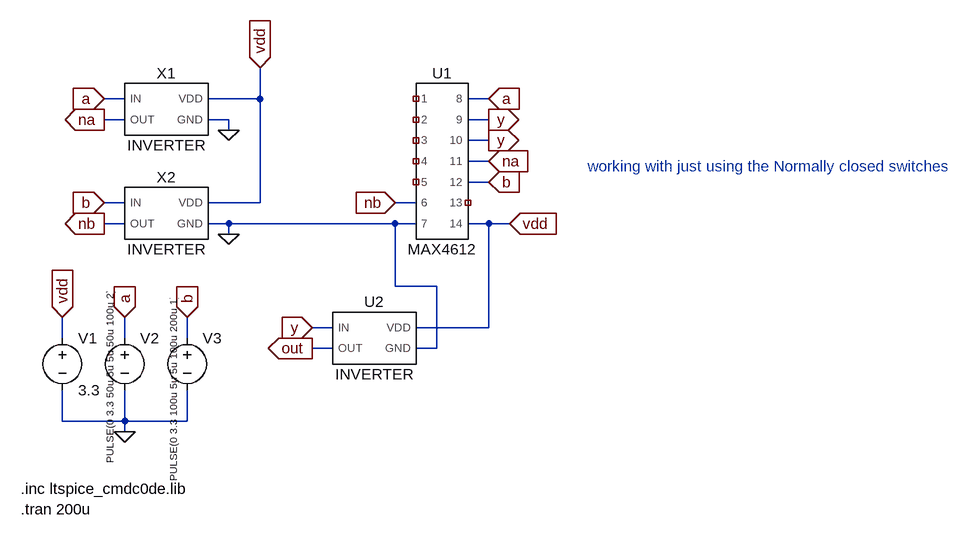
[diagram p0: schematic xor_tg_raw4.asc]
xor_tg_raw4.asc, the LTspice schematic file:
Version 4.1
SHEET 1 1368 1020
WIRE -16 80 -48 80
WIRE 192 80 192 32
WIRE 192 80 112 80
WIRE 544 80 512 80
WIRE -16 112 -48 112
WIRE 144 112 112 112
WIRE 544 112 512 112
WIRE 144 128 144 112
WIRE 544 144 512 144
WIRE 544 176 512 176
WIRE 544 208 512 208
WIRE -16 240 -48 240
WIRE 192 240 192 80
WIRE 192 240 112 240
WIRE 432 240 400 240
WIRE -16 272 -48 272
WIRE 144 272 112 272
WIRE 400 272 144 272
WIRE 432 272 400 272
WIRE 544 272 512 272
WIRE 576 272 544 272
WIRE 144 288 144 272
WIRE 400 368 400 272
WIRE 464 368 400 368
WIRE 304 432 272 432
WIRE 544 432 544 272
WIRE 544 432 432 432
WIRE -112 448 -112 416
WIRE -16 448 -16 416
WIRE 80 448 80 416
WIRE 304 464 272 464
WIRE 464 464 464 368
WIRE 464 464 432 464
WIRE -112 576 -112 528
WIRE -16 576 -16 528
WIRE -16 576 -112 576
WIRE 80 576 80 528
WIRE 80 576 -16 576
WIRE -16 592 -16 576
FLAG -48 80 a
IOPIN -48 80 In
FLAG -48 112 na
IOPIN -48 112 Out
FLAG 144 128 0
FLAG 144 288 0
FLAG -48 240 b
IOPIN -48 240 In
FLAG -48 272 nb
IOPIN -48 272 Out
FLAG -16 592 0
FLAG -112 416 vdd
IOPIN -112 416 In
FLAG -16 416 a
IOPIN -16 416 In
FLAG 80 416 b
IOPIN 80 416 In
FLAG 192 32 vdd
IOPIN 192 32 In
FLAG 576 272 vdd
IOPIN 576 272 In
FLAG 400 240 nb
IOPIN 400 240 In
FLAG 544 80 a
IOPIN 544 80 In
FLAG 544 112 y
IOPIN 544 112 Out
FLAG 544 208 b
IOPIN 544 208 In
FLAG 544 176 na
IOPIN 544 176 In
FLAG 544 144 y
IOPIN 544 144 Out
FLAG 272 432 y
IOPIN 272 432 In
FLAG 272 464 out
IOPIN 272 464 Out
SYMBOL inverter 48 96 R0
SYMATTR InstName X1
SYMATTR SpiceModel ""
SYMBOL inverter 48 256 R0
SYMATTR InstName X2
SYMATTR SpiceModel ""
SYMBOL voltage -112 432 R0
WINDOW 123 0 0 Left 0
WINDOW 39 0 0 Left 0
SYMATTR InstName V1
SYMATTR Value 3.3
SYMBOL voltage -16 432 R0
WINDOW 3 -23 209 VLeft 1
WINDOW 123 0 0 Left 0
WINDOW 39 0 0 Left 0
SYMATTR Value PULSE(0 3.3 50u 5u 5u 50u 100u 2)
SYMATTR InstName V2
SYMBOL voltage 80 432 R0
WINDOW 3 -21 237 VLeft 1
WINDOW 123 0 0 Left 0
WINDOW 39 0 0 Left 0
SYMATTR Value PULSE(0 3.3 100u 5u 5u 100u 200u 1)
SYMATTR InstName V3
SYMBOL max4612 464 176 R0
SYMATTR InstName U1
SYMBOL inverter 368 448 R0
SYMATTR InstName U2
TEXT -176 680 Left 2 !.inc ltspice_cmdc0de.lib\n.tran 200u
TEXT 696 184 Left 2 ;working with just using the Normally closed switches

The netlist it stands for:
* xor_tg_raw4.asc
X§X1 a na vdd 0 INVERTER  ; pins IN OUT VDD GND
X§X2 b nb vdd 0 INVERTER  ; pins IN OUT VDD GND
V1 vdd 0 3.3
V2 a 0 PULSE(0 3.3 50u 5u 5u 50u 100u 2)
V3 b 0 PULSE(0 3.3 100u 5u 5u 100u 200u 1)
X§U1 NC_01 NC_02 NC_03 NC_04 NC_05 nb 0 a y y na b NC_06 vdd MAX4612 MAX4612  ; pins 1 2 3 4 5 6 7 8 9 10 11 12 13 14
X§U2 y out vdd 0 INVERTER INVERTER  ; pins IN OUT VDD GND
.inc ltspice_cmdc0de.lib
.tran 200u
* working with just using the Normally closed switches
.lib yap_cells.lib
.lib ltspice_cmdc0de.lib
.backanno
.end